# Altium schematic sheet External_Hardware.SchDoc
size A4; SheetNumber: 3; SheetTotal: 3
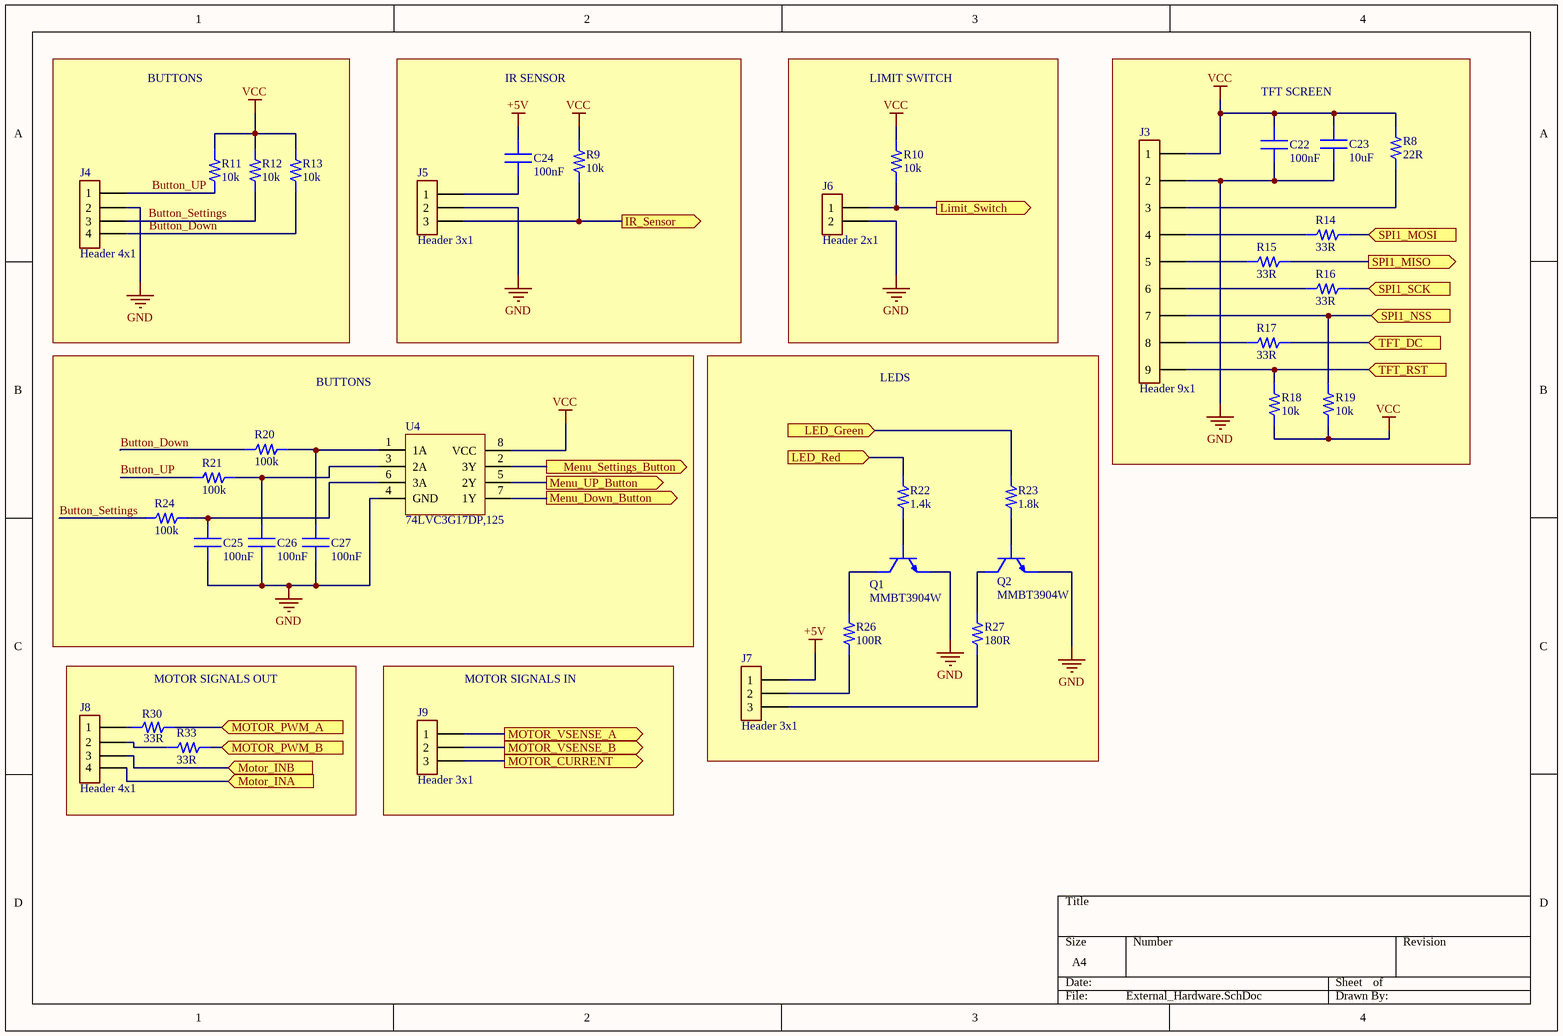
[diagram p0: External_Hardware.SchDoc]

## Parts
C22  100nF  [CAPC 0603 1608X90N]
C23  10uF  [CAPC1608X90N 0603]
C24  100nF  [CAPC 0603 1608X90N]
C25  100nF  [CAPC 0603 1608X90N]
C26  100nF  [CAPC 0603 1608X90N]
C27  100nF  [CAPC 0603 1608X90N]
J3  Header 9x1  [Header 9x1 JST_B9B-PH-K-S]
J4  Header 4x1  [JST_B4B-PH-K-S 1x4 Header]
J5  Header 3x1  [JST_B3B-PH-K-S 1x3 Header]
J6  Header 2x1  [JST_B2B-PH-K-S 1x2 Header]
J7  Header 3x1  [JST_B3B-PH-K-S 1x3 Header]
J8  Header 4x1  [JST_B4B-PH-K-S 1x4 Header]
J9  Header 3x1  [JST_B3B-PH-K-S 1x3 Header]
Q1  MMBT3904W  [MMBT3904_PNJ]
Q2  MMBT3904W  [MMBT3904_PNJ]
R8  22R  [RES 0603 ROYALOHM]
R9  10k  [RES 0603 ROYALOHM]
R10  10k  [RES 0603 ROYALOHM]
R11  10k  [RES 0603 ROYALOHM]
R12  10k  [RES 0603 ROYALOHM]
R13  10k  [RES 0603 ROYALOHM]
R14  33R  [RES 0603 ROYALOHM]
R15  33R  [RES 0603 ROYALOHM]
R16  33R  [RES 0603 ROYALOHM]
R17  33R  [RES 0603 ROYALOHM]
R18  10k  [RES 0603 ROYALOHM]
R19  10k  [RES 0603 ROYALOHM]
R20  100k  [RES 0603 ROYALOHM]
R21  100k  [RES 0603 ROYALOHM]
R22  1.4k  [RES 0603 ROYALOHM]
R23  1.8k  [RES 0603 ROYALOHM]
R24  100k  [RES 0603 ROYALOHM]
R26  100R  [RES 0805 YAGEO C2012X60N]
R27  180R  [RES 0805 YAGEO C2012X60N]
R30  33R  [RES 0603 ROYALOHM]
R33  33R  [RES 0603 ROYALOHM]
U4  74LVC3G17DP,125  [Schmitt Triger 74LVC3G17DP,125 TSSOP8_SOT505-2_NEX]

## Blocks framed on the sheet
BUTTONS: J4 R11-R13
IR SENSOR: C24 J5 R9
LIMIT SWITCH: J6 R10
TFT SCREEN: C22 C23 J3 R8 R14-R19
BUTTONS: C25-C27 R20 R21 R24 U4
LEDS: J7 Q1 Q2 R22 R23 R26 R27
MOTOR SIGNALS OUT: J8 R30 R33
MOTOR SIGNALS IN: J9

## Ports
IR_Sensor (out, see MCU[2C]), LED_Green (in, see MCU[2C]), LED_Red (in, see MCU[2C]), Limit_Switch (out, see MCU[2C]), Menu_Down_Button (out, see MCU[2C]), Menu_Settings_Button (out, see MCU[2C]), Menu_UP_Button (out, see MCU[2C]), MOTOR_CURRENT (out, see MCU[1C]), Motor_INA (in, see MCU[2C]), Motor_INB (in, see MCU[2C]), MOTOR_PWM_A (in, see MCU[2C]), MOTOR_PWM_B (in, see MCU[2C]), MOTOR_VSENSE_A (out, see MCU[1C]), MOTOR_VSENSE_B (out, see MCU[1D]), SPI1_MISO (out, see MCU[2B]), SPI1_MOSI (in, see MCU[2B]), SPI1_NSS (in, see MCU[2B]), SPI1_SCK (in, see MCU[2B]), TFT_DC (in, see MCU[2B]), TFT_RST (in, see MCU[2B])

## Nets
+5V: C24.2 J7.1
GND: C22.1 C23.1 C25.1 C26.2 C27.1 J3.2 J4.2 J5.2 J6.2 Q1.2(Emitter) Q2.2(Emitter) U4.4(GND)
VCC: C22.2 C23.2 J3.1 R8.2 R9.2 R10.2 R11.2 R12.2 R13.2 R18.1 R19.1 U4.8(VCC)
Button_Down: J4.4 R13.1 R20.1
Button_Settings: J4.3 R12.1 R24.1
Button_UP: J4.1 R11.1 R21.1
IR_Sensor: J5.3 R9.1 ; port IR_Sensor
LED_Green: R23.2 ; port LED_Green
LED_Red: R22.2 ; port LED_Red
Limit_Switch: J6.1 R10.1 ; port Limit_Switch
Menu_Down_Button: U4.7(1Y) ; port Menu_Down_Button
Menu_Settings_Button: U4.2(3Y) ; port Menu_Settings_Button
Menu_UP_Button: U4.5(2Y) ; port Menu_UP_Button
MOTOR_CURRENT: J9.3 ; port MOTOR_CURRENT
Motor_INA: J8.4 ; port Motor_INA
Motor_INB: J8.3 ; port Motor_INB
MOTOR_PWM_A: R30.2 ; port MOTOR_PWM_A
MOTOR_PWM_B: R33.2 ; port MOTOR_PWM_B
MOTOR_VSENSE_A: J9.1 ; port MOTOR_VSENSE_A
MOTOR_VSENSE_B: J9.2 ; port MOTOR_VSENSE_B
SPI1_MISO: R15.2 ; port SPI1_MISO
SPI1_MOSI: R14.2 ; port SPI1_MOSI
SPI1_NSS: J3.7 R19.2 ; port SPI1_NSS
SPI1_SCK: R16.2 ; port SPI1_SCK
TFT_DC: R17.2 ; port TFT_DC
TFT_RST: J3.9 R18.2 ; port TFT_RST
NetC24_1: C24.1 J5.1
NetC25_2: C25.2 R24.2 U4.6(3A)
NetC26_1: C26.1 R21.2 U4.3(2A)
NetC27_2: C27.2 R20.2 U4.1(1A)
NetJ3_3: J3.3 R8.1
NetJ3_4: J3.4 R14.1
NetJ3_5: J3.5 R15.1
NetJ3_6: J3.6 R16.1
NetJ3_8: J3.8 R17.1
NetJ7_2: J7.2 R26.1
NetJ7_3: J7.3 R27.1
NetJ8_1: J8.1 R30.1
NetJ8_2: J8.2 R33.1
NetQ1_1: Q1.1(Base) R22.1
NetQ1_3: Q1.3(Collector) R26.2
NetQ2_1: Q2.1(Base) R23.1
NetQ2_3: Q2.3(Collector) R27.2

## Library data of the parts
C22 C24-C27 = CAP 0603 100nF CC0603KPX7R8BB104: MLCC (1608) 0603 100nF 25VDC ±10% X7R; Manufacturer: YAGEO; Package / Case: 0603 (1608 Metric); Operating Temperature: -55°C ~ 125°C; Temperature Coefficient: X7R; Voltage - Rated: 25 VDC; Tolerance: ±10%; Capacitance: 100nF; Manufacturer Product Number: CC0603KPX7R8BB104; ComponentLink1Description: Product Site; ComponentLink1URL: https://www.ozdisan.com/p/smt-smd-ve-mlcc-kapasitorler-184/yageo-cc0603kpx7r8bb104-747645
C23 = CAP 0603 10uF CL10A106KP8NNNC: MLCC (1608) 0603 10uF 10VDC ±10% X5R; Manufacturer: SAMSUNG; Operation Temperature: -55°C ~ 85°C; Tolerance: ±10 %; Voltage Rating: 10VDC; Capacitance: 10uF; Package / Case: 0603 (1608 Metric); Manufacturer Code: CL10A106KP8NNNC; ComponentLink1Description: Product Site; ComponentLink1URL: https://www.ozdisan.com/p/smt-smd-ve-mlcc-kapasitorler-184/samsung-cl10a106kp8nnnc-350863
J3 = Header 9x1 DS1066-9MVW6S: CON.T.B.2.00MM 9P 180C MALE WHITE CONNFLY; Pitch - Mating: 0.079" (2.00mm); Mounting Type: Through Hole; Contact Type: Male Pin; Series: PH; Manufacturer Product Number: DS1066-9MVW6S; Manufacturer: CONNFLY; ComponentLink1Description: Product Site; ComponentLink1URL: https://www.ozdisan.com/p/pcb-konnektorler-310/connfly-ds1066-9mvw6s-493789
J4 J8 = Header 4x1 DS1066-4MVW6X: CON.T.B.2MM 4P 180C MALE WHITE CONNFLY; Pitch - Mating: 0.079" (2.00mm); Mounting Type: Through Hole; Contact Type: Male Pin; Series: PH; Manufacturer Product Number: DS1066-4MVW6X; Manufacturer: CONNFLY; ComponentLink1Description: Product Site; ComponentLink1URL: https://www.ozdisan.com/p/pcb-konnektorler-310/connfly-ds1066-4mvw6x-357972
J5 J7 J9 = Header 3x1 DS1066-3MVW6X: CON.T.B.2.00MM 3P 180C MALE CONNFLY; Pitch - Mating: 0.079" (2.00mm); Mounting Type: Through Hole; Contact Type: Male Pin; Series: PH; Manufacturer Product Number: DS1066-3MVW6X; Manufacturer: CONNFLY; ComponentLink1Description: Product Site; ComponentLink1URL: https://www.ozdisan.com/p/pcb-konnektorler-310/connfly-ds1066-3mvw6x-493781
J6 = Header 2x1 DS1066-2MVW6X: CON.T.B.2.00MM 2P 180C MALE CONNFLY; Voltage Rating: 100V; Current Rating (Amps): 2A; Pitch - Mating: 0.079" (2.00mm); Mounting Type: Through Hole; Contact Type: Male Pin; Series: PH; Manufacturer Product Number: DS1066-2MVW6X; Manufacturer: CONNFLY; ComponentLink1Description: Product Site; ComponentLink1URL: https://www.ozdisan.com/p/pcb-konnektorler-310/connfly-ds1066-2mvw6x-423540
Q1 Q2 = NPN Transistor MMBT3904W: Bipolar (BJT) Transistor NPN 40 V 200 mA 150 mW Surface Mount SOT-323; Manufacturer Product Number: MMBT3904W_R1_00001; Manufacturer: Panjit International Inc.; DC Current Gain (hFE): 100 @ 10mA, 1V; Power - Max: 150 mW; Current - Collector Cutoff (Max): 50nA; Voltage - Collector Emitter Breakdown (Max): 40 V; Current - Collector (Ic) (Max): 200 mA; Package / Case: SOT-323; Transistor Type: NPN; Product Site: https://www.digikey.com/en/products/detail/panjit-international-inc/MMBT3904W-R1-00001/14660622
R8 = RES 0603 22 Ohms 0603SAJ0220T5E: RES.(1608) 0603 22 Ohms 5% 1/10W-S 200PPM; Manufacturer: ROYALOHM; Power (Watts): 0.1W, 1/10W; Resistance: 22 Ohms; Operating Temperature: -55°C ~ 155°C; Package / Case: 0603 (1608 Metric); Tolerance: ±5%; Manufacturer Product Number: 0603SAJ0220T5E; ComponentLink1Description: Product Site; ComponentLink1URL: https://www.ozdisan.com/p/smt-smd-ve-cip-direncler-194/royalohm-0603saj0220t5e-341987
R9-R13 R18 R19 = RES 0603 10k 0603SAJ0103T5E: RES.(1608) 0603 10K Ohms 5% 1/10W-S 100PPM; Manufacturer: ROYALOHM; Power (Watts): 0.1W, 1/10W; Operating Temperature: -55°C ~ 155°C; Package / Case: 0603 (1608 Metric); Tolerance: ±5 %; Manufacturer Product Number: 0603SAJ0103T5E; Resistance: 10 kOhms; ComponentLink1Description: Product Site; ComponentLink1URL: https://www.ozdisan.com/p/smt-smd-ve-cip-direncler-194/royalohm-0603saj0103t5e-336243
R14-R17 R30 R33 = RES 0603 33 Ohms 0603SAJ0330T5E: RES.(1608) 0603 33 Ohms 5% 1/10W-S 200PPM; Manufacturer: ROYALOHM; Power (Watts): 0.1W, 1/10W; Resistance: 33 Ohms; Operating Temperature: -55°C ~ 155°C; Package / Case: 0603 (1608 Metric); Tolerance: ±5%; Manufacturer Product Number: 0603SAJ0330T5E; ComponentLink1Description: Product Site
  R14-R17 R30: ComponentLink1URL: https://www.ozdisan.com/p/smt-smd-ve-cip-direncler-194/royalohm-0603saj0220t5e-341987
  R33: ComponentLink1URL: https://www.ozdisan.com/p/smt-smd-ve-cip-direncler-194/royalohm-0603saj0330t5e-346969
R20 R21 R24 = RES 0603 100k 0603SAF1003T5E: RES.(1608) 0603 100K Ohms 1% 1/10W-S 100PPM; Manufacturer: ROYALOHM; Power (Watts): 0.1W, 1/10W; Tolerance: ±5 %; Operating Temperature: -55°C ~ 155°C; Package / Case: 0603 (1608 Metric); Manufacturer Product Number: 0603SAF1003T5E; Resistance: 100 kOhms; ComponentLink1Description: Product Site; ComponentLink1URL: https://www.ozdisan.com/p/smt-smd-ve-cip-direncler-194/royalohm-0603saf1003t5e-339374
R22 = RES 0603 1.4k 0603SAF1401T5E: RES.(1608) 0603 1.4K Ohms 1% 1/10W-S 100PPM; Manufacturer: ROYALOHM; Power (Watts): 0.1W, 1/10W; Operating Temperature: -55°C ~ 155°C; Package / Case: 0603 (1608 Metric); Tolerance: ±1 %; Manufacturer Product Number: 0603SAF1401T5E; Resistance: 1.4 k Ohms; ComponentLink1Description: Product Site; ComponentLink1URL: https://www.ozdisan.com/p/smt-smd-ve-cip-direncler-194/royalohm-0603saf1401t5e-505856
R23 = RES 0603 1.8k 0603SAF1801T5E: RES.(1608) 0603 1.8K Ohms 1% 1/10W-S 100PPM; Manufacturer: ROYALOHM; Power (Watts): 0.1W, 1/10W; Operating Temperature: -55°C ~ 155°C; Package / Case: 0603 (1608 Metric); Tolerance: ±1 %; Manufacturer Product Number: 0603SAF1801T5E; Resistance: 1.8k Ohms; ComponentLink1Description: Product Site; ComponentLink1URL: https://www.ozdisan.com/p/smt-smd-ve-cip-direncler-194/royalohm-0603saf1801t5e-359796
R26 = RES 0805 100R 0805S8F1000T5E: RES.(2012) 0805 100 Ohms 1% 1/8W-S 200PPM; Manufacturer: ROYALOHM; Power: 1/8W; Max Working Current: 5A; Max Working Voltage: 150; Resistance: 100 Ohms; Tolerance: ±1 %; Package / Case: 0805; Manufacturer Code: 0805S8F1000T5E; ComponentLink1Description: Product Site; ComponentLink1URL: https://www.ozdisan.com/p/smt-smd-ve-cip-direncler-194/royalohm-0805s8j0181t5e-335052
R27 = RES 0805 180R 0805S8J0181T5E: RES.(2012) 0805 180 Ohms 5% 1/8W-S 100PPM; Manufacturer: ROYALOHM; Power: 1/8W; Tolerance: ±1 %; Max Working Current: 5A; Max Working Voltage: 150; Resistance: 180 Ohms; Package / Case: 0805; Manufacturer Code: 0805S8J0181T5E; ComponentLink1Description: Product Site; ComponentLink1URL: https://www.ozdisan.com/p/smt-smd-ve-cip-direncler-194/royalohm-0805s8j0181t5e-335052
U4 = Schmitt Triger 74LVC3G17DP,125: Buffer, Non-Inverting 3 Element 1 Bit per Element Push-Pull Output 8-TSSOP; Manufacturer: Nexperia USA Inc.; Voltage - Supply: 1.65V ~ 5.5V; Current - Output High, Low: 32mA, 32mA; Input Type: Schmitt Trigger; Number of Elements: 3; Operating Temperature: -40°C ~ 125°C (TA); Output Type: Push-Pull; Logic Type: Buffer, Non-Inverting; Manufacturer Product Number: 74LVC3G17DP,125; ComponentLink1Description: Product Site; ComponentLink1URL: https://www.ozdisan.com/p/buffer-driver-receiver-ve-transceiver-entegreleri-244/nexperia-74lvc3g17dp-125-1066574